# EAGLE design SRV-1_Expansion_Board (EAGLE 6.4)
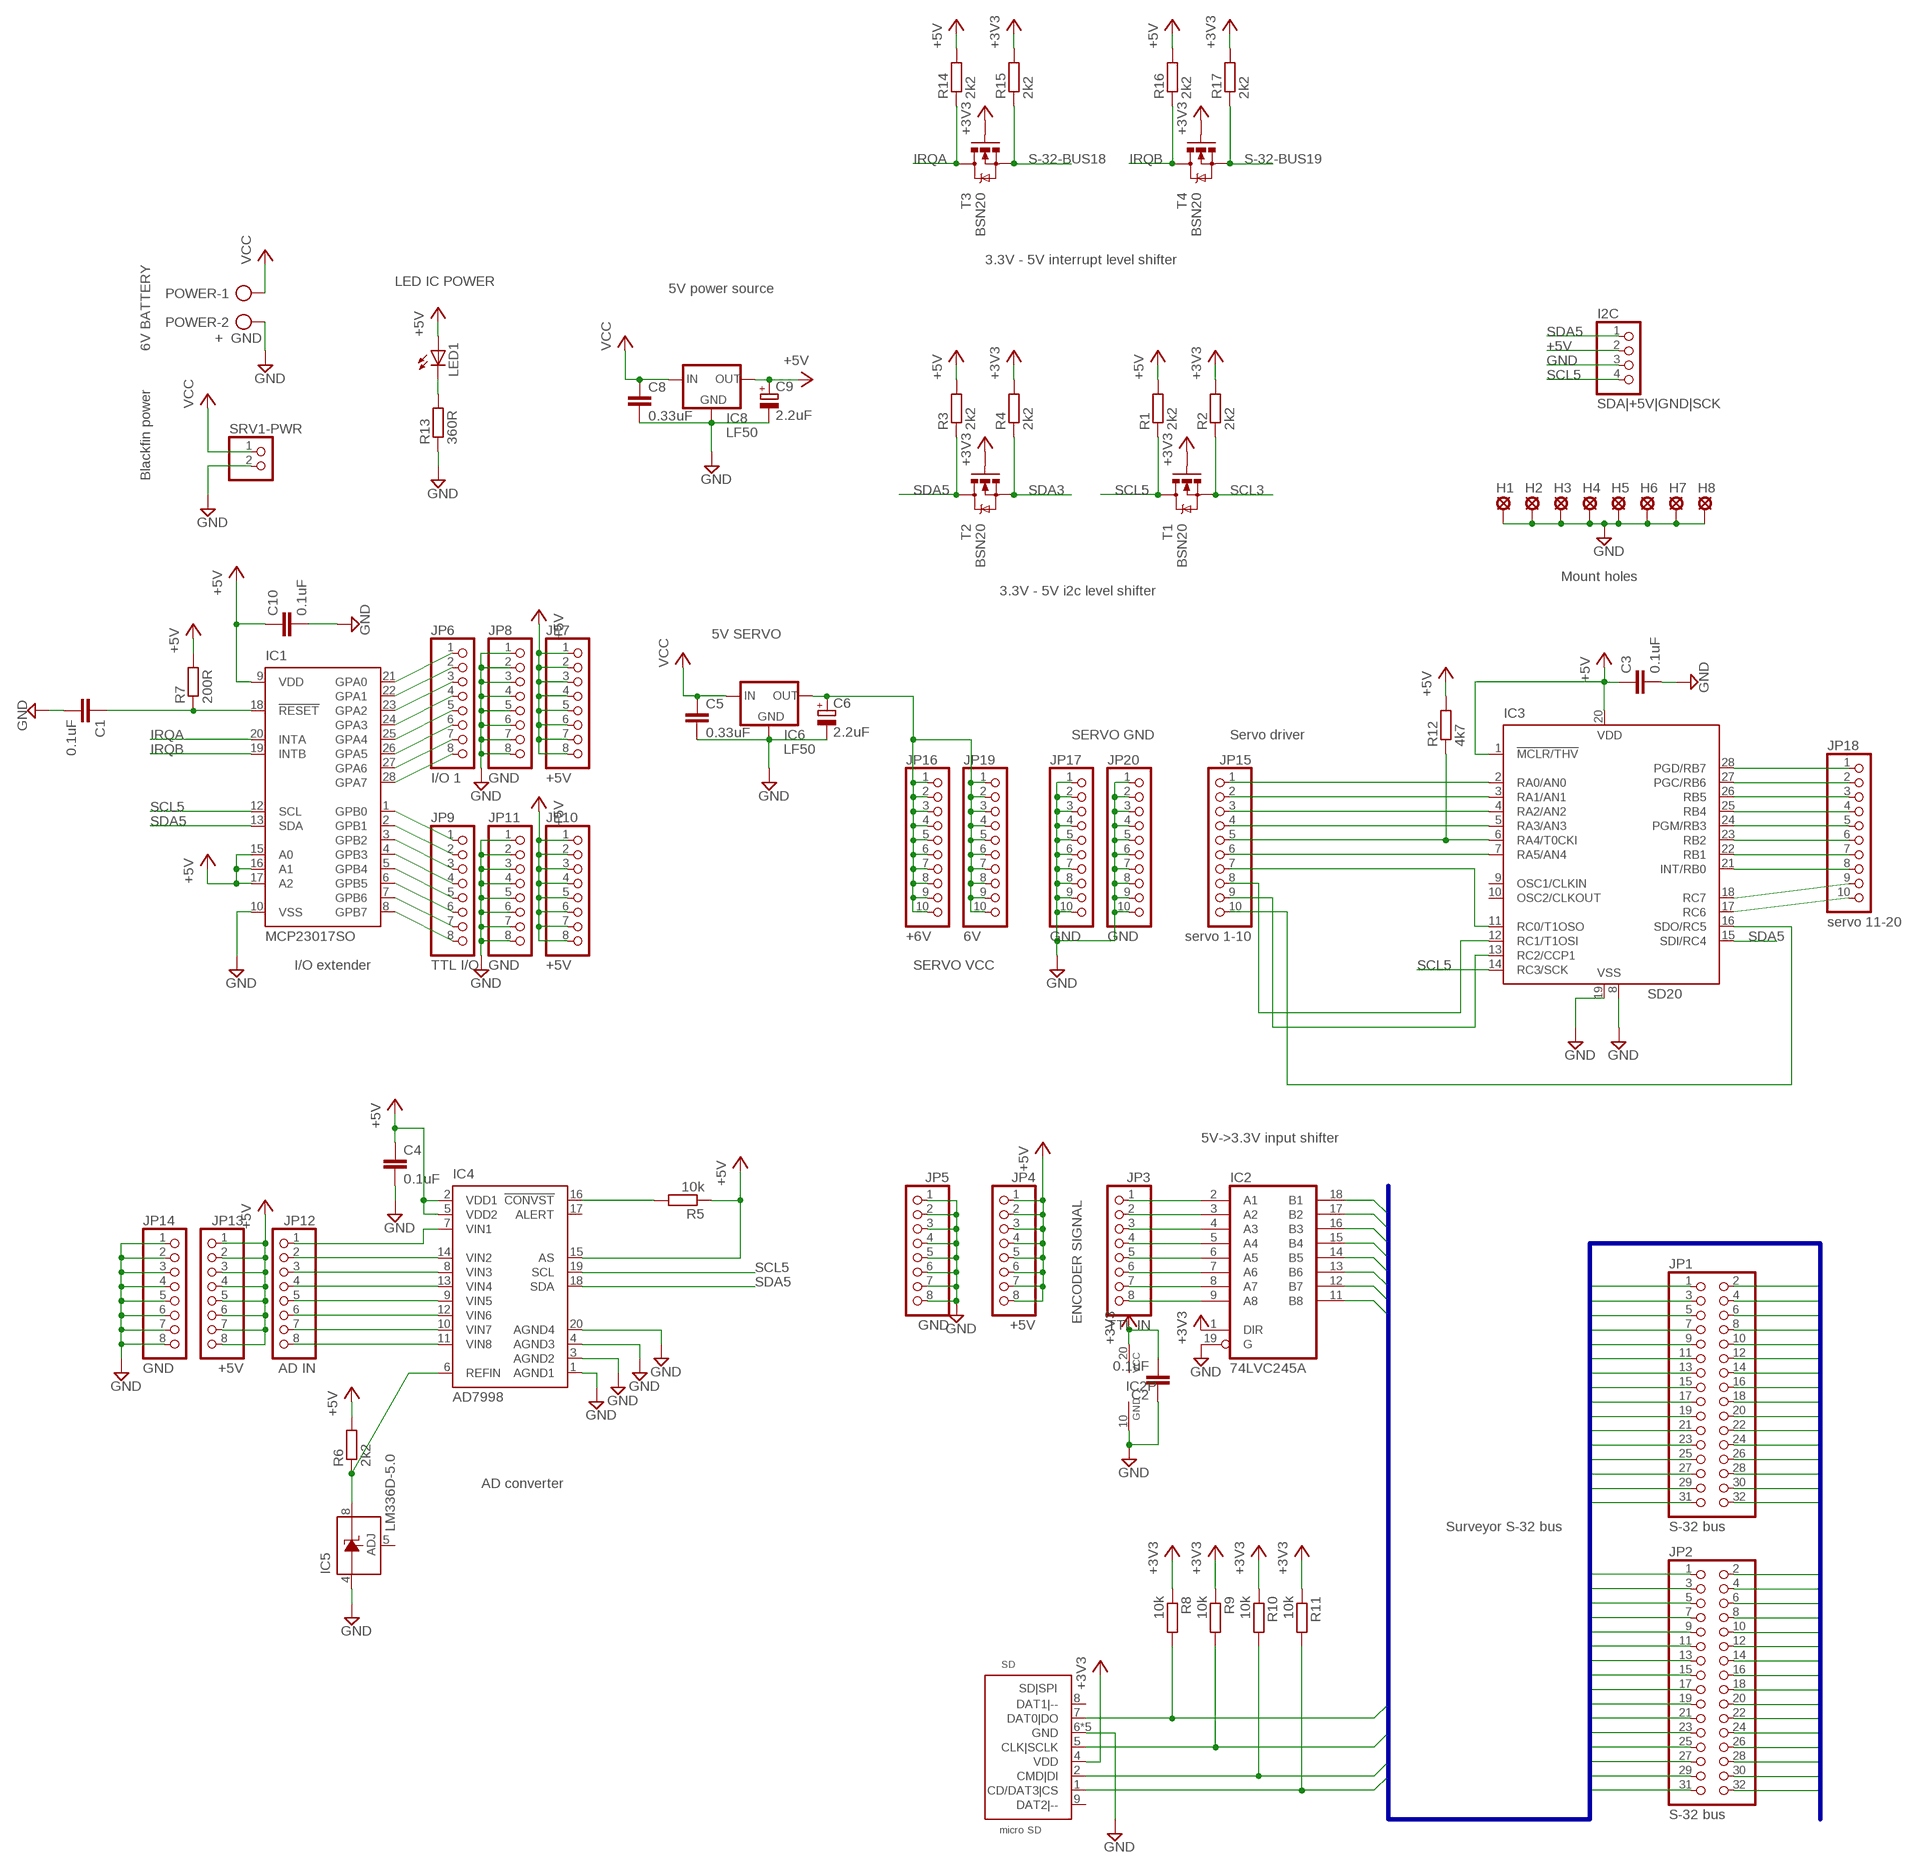
[diagram p0: schematic, sheet 1]

## Parts
C1  0.1uF  CAPACITORC-0805BIG  [0805BIG]
C2  0.1uF  CAPACITORC-0805BIG  [0805BIG]
C3  0.1uF  CAPACITORC-0805BIG  [0805BIG]
C4  0.1uF  CAPACITORC-0805BIG  [0805BIG]
C5  0.33uF  CAPACITORC-0805BIG  [0805BIG]
C6  2.2uF  CPOL-EUE1.8-4  [E1,8-4]
C8  0.33uF  CAPACITORC-0805BIG  [0805BIG]
C9  2.2uF  CPOL-EUE1.8-4  [E1,8-4]
C10  0.1uF  CAPACITORC-0805BIG  [0805BIG]
H1  LSP35  [LSP35]
H2  LSP35  [LSP35]
H3  LSP35  [LSP35]
H4  LSP35  [LSP35]
H5  LSP40  [LSP40]
H6  LSP40  [LSP40]
H7  LSP40  [LSP40]
H8  LSP40  [LSP40]
I2C  SDA|+5V|GND|SCK  PINHD-1X4  [1X04]
IC1  MCP23017SO  [SO28W]
IC2  74LVC245A  74LS245DW  [SO20W]
IC3  SD20  PIC16F872P  [DIL28-3]
IC4  AD7998  [TSSOP20]
IC5  LM336D-5.0  LM336D  [SO08]
IC6  LF50  78XXCDT  [DPAK]
IC8  LF50  78XXCDT  [DPAK]
JP1  S-32 bus  PINHD-2X16  [2X16]
JP2  S-32 bus  PINHD-2X16  [2X16]
JP3  TTL IN  PINHD-1X8  [1X08]
JP4  +5V  PINHD-1X8  [1X08]
JP5  GND  PINHD-1X8  [1X08]
JP6  I/O 1  PINHD-1X8  [1X08]
JP7  +5V  PINHD-1X8  [1X08]
JP8  GND  PINHD-1X8  [1X08]
JP9  TTL I/O  PINHD-1X8  [1X08]
JP10  +5V  PINHD-1X8  [1X08]
JP11  GND  PINHD-1X8  [1X08]
JP12  AD IN  PINHD-1X8  [1X08]
JP13  +5V  PINHD-1X8  [1X08]
JP14  GND  PINHD-1X8  [1X08]
JP15  servo 1-10  PINHD-1X10  [1X10]
JP16  +6V  PINHD-1X10  [1X10]
JP17  GND  PINHD-1X10  [1X10]
JP18  servo 11-20  PINHD-1X10  [1X10]
JP19  6V  PINHD-1X10  [1X10]
JP20  GND  PINHD-1X10  [1X10]
LED1  LEDCHIPLED_1206  [CHIPLED_1206]
POWER  + GND  AK500/2  [AK500/2]
R1  2k2  RESISTORR-0805BIG  [0805BIG]
R2  2k2  RESISTORR-0805BIG  [0805BIG]
R3  2k2  RESISTORR-0805BIG  [0805BIG]
R4  2k2  RESISTORR-0805BIG  [0805BIG]
R5  10k  RESISTORR-0805BIG  [0805BIG]
R6  2k2  RESISTORR-0805BIG  [0805BIG]
R7  200R  RESISTORR-0805BIG  [0805BIG]
R8  10k  RESISTORR-0805BIG  [0805BIG]
R9  10k  RESISTORR-0805BIG  [0805BIG]
R10  10k  RESISTORR-0805BIG  [0805BIG]
R11  10k  RESISTORR-0805BIG  [0805BIG]
R12  4k7  RESISTORR-0805BIG  [0805BIG]
R13  360R  RESISTORR-0805BIG  [0805BIG]
R14  2k2  RESISTORR-0805BIG  [0805BIG]
R15  2k2  RESISTORR-0805BIG  [0805BIG]
R16  2k2  RESISTORR-0805BIG  [0805BIG]
R17  2k2  RESISTORR-0805BIG  [0805BIG]
SD  micro SD  MICRO-SD_CARD_SOCKET  [SD-500901-0801]
SRV1-PWR  PINHD-1X2  [1X02]
T1  BSN20  [SOT23]
T2  BSN20  [SOT23]
T3  BSN20  [SOT23]
T4  BSN20  [SOT23]

## Nets
+3V3: C2.2 IC2.1(DIR) IC2.20(VCC) JP1.1 JP2.1 R2.2 R4.2 R8.1 R9.1 R10.1 R11.1 R15.2 R17.2 SD.4(VDD) T1.1(G) T2.1(G) T3.1(G) T4.1(G)
+5V: C3.1 C4.1 C9.+ C10.1 I2C.2 IC1.9(VDD) IC1.15(A0) IC1.16(A1) IC1.17(A2) IC3.1(!MCLR/THV) IC3.20(VDD) IC4.2(VDD1) IC4.5(VDD2) IC4.15(AS) IC8.3(OUT) JP4.1 JP4.2 JP4.3 JP4.4 JP4.5 JP4.6 JP4.7 JP4.8 JP7.1 JP7.2 JP7.3 JP7.4 JP7.5 JP7.6 JP7.7 JP7.8 JP10.1 JP10.2 JP10.3 JP10.4 JP10.5 JP10.6 JP10.7 JP10.8 JP13.1 JP13.2 JP13.3 JP13.4 JP13.5 JP13.6 JP13.7 JP13.8 LED1.A R1.2 R3.2 R5.1 R6.2 R7.2 R12.2 R14.2 R16.2
GND: C1.2 C2.1 C3.2 C4.2 C5.2 C6.- C8.2 C9.- C10.2 H1.MP H2.MP H3.MP H4.MP H5.MP H6.MP H7.MP H8.MP I2C.3 IC1.10(VSS) IC2.10(GND) IC2.19(G) IC3.8(VSS) IC3.19(VSS) IC4.1(AGND1) IC4.3(AGND2) IC4.4(AGND3) IC4.20(AGND4) IC5.4(A) IC6.2(GND) IC8.2(GND) JP1.2 JP1.16 JP2.2 JP2.16 JP5.1 JP5.2 JP5.3 JP5.4 JP5.5 JP5.6 JP5.7 JP5.8 JP8.1 JP8.2 JP8.3 JP8.4 JP8.5 JP8.6 JP8.7 JP8.8 JP11.1 JP11.2 JP11.3 JP11.4 JP11.5 JP11.6 JP11.7 JP11.8 JP14.1 JP14.2 JP14.3 JP14.4 JP14.5 JP14.6 JP14.7 JP14.8 JP17.1 JP17.2 JP17.3 JP17.4 JP17.5 JP17.6 JP17.7 JP17.8 JP17.9 JP17.10 JP20.1 JP20.2 JP20.3 JP20.4 JP20.5 JP20.6 JP20.7 JP20.8 JP20.9 JP20.10 POWER.2 R13.1 SD.6(GND) SD.GND1(GND) SD.GND2(GND) SD.GND3(GND) SD.GND4(GND) SRV1-PWR.2
IRQA: IC1.20(INTA) R14.1 T3.3(D)
IRQB: IC1.19(INTB) R16.1 T4.3(D)
N$1: IC4.16(!CONVST) R5.2
N$2: IC2.9(A8) JP3.8
N$3: IC1.21(GPA0) JP6.1
N$7: IC1.22(GPA1) JP6.2
N$8: IC4.6(REFIN) IC5.8(C) R6.1
N$9: IC3.2(RA0/AN0) JP15.1
N$10: IC1.23(GPA2) JP6.3
N$11: IC1.24(GPA3) JP6.4
N$12: IC1.25(GPA4) JP6.5
N$13: C1.1 IC1.18(!RESET) R7.1
N$14: IC1.26(GPA5) JP6.6
N$15: IC1.27(GPA6) JP6.7
N$16: IC1.28(GPA7) JP6.8
N$17: IC1.1(GPB0) JP9.1
N$18: IC1.2(GPB1) JP9.2
N$19: IC1.3(GPB2) JP9.3
N$20: IC1.4(GPB3) JP9.4
N$21: IC1.5(GPB4) JP9.5
N$22: IC1.6(GPB5) JP9.6
N$23: IC1.7(GPB6) JP9.7
N$24: IC1.8(GPB7) JP9.8
N$25: IC3.16(SDO/RC5) JP15.10
N$26: IC2.2(A1) JP3.1
N$27: IC2.3(A2) JP3.2
N$28: IC2.4(A3) JP3.3
N$29: IC2.5(A4) JP3.4
N$30: IC2.6(A5) JP3.5
N$31: IC2.7(A6) JP3.6
N$32: IC2.8(A7) JP3.7
N$33: IC4.11(VIN8) JP12.8
N$42: IC3.3(RA1/AN1) JP15.2
N$43: IC3.4(RA2/AN2) JP15.3
N$44: IC3.5(RA3/AN3) JP15.4
N$45: IC3.6(RA4/T0CKI) JP15.5 R12.1
N$46: IC3.7(RA5/AN4) JP15.6
N$47: IC3.11(RC0/T1OSO) JP15.7
N$48: IC3.12(RC1/T1OSI) JP15.8
N$49: IC3.13(RC2/CCP1) JP15.9
N$50: IC3.28(PGD/RB7) JP18.1
N$51: IC3.27(PGC/RB6) JP18.2
N$52: IC3.26(RB5) JP18.3
N$53: IC3.25(RB4) JP18.4
N$54: IC3.24(PGM/RB3) JP18.5
N$55: IC3.23(RB2) JP18.6
N$56: IC3.22(RB1) JP18.7
N$57: IC3.21(INT/RB0) JP18.8
N$58: IC3.18(RC7) JP18.9
N$59: IC3.17(RC6) JP18.10
N$61: IC4.7(VIN1) JP12.1
N$62: IC4.14(VIN2) JP12.2
N$63: IC4.8(VIN3) JP12.3
N$64: IC4.13(VIN4) JP12.4
N$65: IC4.9(VIN5) JP12.5
N$66: IC4.12(VIN6) JP12.6
N$67: IC4.10(VIN7) JP12.7
N$71: LED1.C R13.2
S-32-BUS3: JP1.3 JP2.3
S-32-BUS4: JP1.4 JP2.4
S-32-BUS5: JP1.5 JP2.5
S-32-BUS6: JP1.6 JP2.6
S-32-BUS7: JP1.7 JP2.7
S-32-BUS8: JP1.8 JP2.8
S-32-BUS9: JP1.9 JP2.9 R10.2 SD.2(CMD|DI)
S-32-BUS10: JP1.10 JP2.10 R8.2 SD.7(DAT0|DO)
S-32-BUS11: JP1.11 JP2.11 R9.2 SD.5(CLK|SCLK)
S-32-BUS12: JP1.12 JP2.12 R11.2 SD.1(CD/DAT3|CS)
S-32-BUS13: JP1.13 JP2.13
S-32-BUS17: JP1.17 JP2.17
S-32-BUS18: JP1.18 JP2.18 R15.1 T3.2(S)
S-32-BUS19: JP1.19 JP2.19 R17.1 T4.2(S)
S-32-BUS20: JP1.20 JP2.20
S-32-BUS21: JP1.21 JP2.21
S-32-BUS22: JP1.22 JP2.22
S-32-BUS23: JP1.23 JP2.23
S-32-BUS24: JP1.24 JP2.24
S-32-BUS25: IC2.18(B1) JP1.25 JP2.25
S-32-BUS26: IC2.17(B2) JP1.26 JP2.26
S-32-BUS27: IC2.16(B3) JP1.27 JP2.27
S-32-BUS28: IC2.15(B4) JP1.28 JP2.28
S-32-BUS29: IC2.14(B5) JP1.29 JP2.29
S-32-BUS30: IC2.13(B6) JP1.30 JP2.30
S-32-BUS31: IC2.12(B7) JP1.31 JP2.31
S-32-BUS32: IC2.11(B8) JP1.32 JP2.32
SCL3: JP1.14 JP2.14 R2.1 T1.2(S)
SCL5: I2C.4 IC1.12(SCL) IC3.14(RC3/SCK) IC4.19(SCL) R1.1 T1.3(D)
SDA3: JP1.15 JP2.15 R4.1 T2.2(S)
SDA5: I2C.1 IC1.13(SDA) IC3.15(SDI/RC4) IC4.18(SDA) R3.1 T2.3(D)
SERVO+5V: C6.+ IC6.3(OUT) JP16.1 JP16.2 JP16.3 JP16.4 JP16.5 JP16.6 JP16.7 JP16.8 JP16.9 JP16.10 JP19.1 JP19.2 JP19.3 JP19.4 JP19.5 JP19.6 JP19.7 JP19.8 JP19.9 JP19.10
VCC: C5.1 C8.1 IC6.1(IN) IC8.1(IN) POWER.1 SRV1-PWR.1
Unconnected: IC3.9(OSC1/CLKIN) IC3.10(OSC2/CLKOUT) IC4.17(ALERT) IC5.5(ADJ) SD.8(DAT1|--) SD.9(DAT2|--)

## Buses
+3V3,GND,S-32-BUS[3..13],SCL3,SDA3,S-32-BUS[17..32]

## Notes on the sheet
- 3.3V - 5V interrupt level shifter
- LED IC POWER
- 5V power source
- 6V BATTERY
- Blackfin power
- Mount holes
- 3.3V - 5V i2c level shifter
- 5V SERVO
- SERVO GND | Servo driver
- I/O extender | SERVO VCC
- 5V->3.3V input shifter
- ENCODER SIGNAL
- AD converter
- Surveyor S-32 bus

## Library data of the parts
C1-C5 C8 C10 = MART2013:CAPACITOR
C6 C9 = resistor:CPOL-EU: POLARIZED CAPACITOR, European symbol
H1-H4 = solpad:LSP35: SOLDER PAD drill 3.5 mm
H5-H8 = solpad:LSP40: SOLDER PAD drill 4.0 mm
I2C = pinhead:PINHD-1X4: PIN HEADER
IC1 = edited:MCP23017: http://ww1.microchip.com/downloads/en/DeviceDoc/21952a.pdf Source: http://ww1.microchip.com/downloads/en/DeviceDoc/21952a.pdf; MF: MICROCHIP; MPN: MCP23017-E/SO; OC_FARNELL: 1332087; OC_NEWARK: 31K2958
IC2 = 74xx-eu:74*245: Octal BUS TRANSCEIVER, 3-state
IC3 = microchip:PIC16*872: MICROCONTROLLER flash type; MF: MICROCHIP; MPN: PIC16F872-I/SP; OC_FARNELL: 9761012; OC_NEWARK: 12C1945
IC4 = edited:AD7998: 2-Channel, 12-Bit ADC with I2C-Compatible Interface 10-Lead MSOP Source: http://www.analog.com/UploadedFiles/Data_Sheets/224965274AD7992_0.pdf
IC5 = linear:LM336: 2.5-V INTEGRATED REFERENCE CIRCUITS LM236 Source: http://focus.ti.com/lit/ds/symlink/lm336-2.5.pdf
IC6 IC8 = Davidova:78XX: VOLTAGE REGULATOR
JP1 JP2 = pinhead:PINHD-2X16: PIN HEADER
JP3-JP14 = pinhead:PINHD-1X8: PIN HEADER
JP15-JP20 = pinhead:PINHD-1X10: PIN HEADER
LED1 = led:LED: LED OSRAM: - CHIPLED LG R971, LG N971, LY N971, LG Q971, LY Q971, LO R971, LY R971 LH N974, LH R974 LS Q976, LO Q976, LY Q976 LO Q996 - Hyper CHIPLED LW Q18S LB Q993, LB Q99A, LB R99A - SideLED LS A670, LO A670, LY A670, LG A670, LP A670 LB A673, LV A673, LT A673, LW A673 LH A674 LY A675 LS A676, LA A676, LO A676, LY A676, LW A676 LS A679, LY A679, LG A679 - Hyper Micro SIDELED® LS Y876, LA Y876, LO Y876, LY Y876 LT Y87S - SmartLED LW L88C, LW L88S LB L89C, LB L89S, LG L890 LS L89K, LO L89K, LY L89K LS L896, LA L896, LO L896, LY L896 - TOPLED LS T670, LO T670, LY T670, LG T670, LP T670 LSG T670, LSP T670, LSY T670, LOP T670, LYG T670 LG T671, LOG T671, LSG T671 LB T673, LV T673, LT T673, LW T673 LH T674 LS T676, LA T676, LO T676, LY T676, LB T676, LH T676, LSB T676, LW T676 LB T67C, LV T67C, LT T67C, LS T67K, LO T67K, LY T67K, LW E67C LS E67B, LA E67B, LO E67B, LY E67B, LB E67C, LV E67C, LT E67C LW T67C LS T679, LY T679, LG T679 LS T770, LO T770, LY T770, LG T770, LP T770 LB T773, LV T773, LT T773, LW T773 LH T774 LS E675, LA E675, LY E675, LS T675 LS T776, LA T776, LO T776, LY T776, LB T776 LHGB T686 LT T68C, LB T68C - Hyper Mini TOPLED® LB M676 - Mini TOPLED Santana® LG M470 LS M47K, LO M47K, LY M47K Source: http://www.osram.convergy.de LUXEON: - LUMILED® LXK2-PW12-R00, LXK2-PW12-S00, LXK2-PW14-U00, LXK2-PW14-V00 LXK2-PM12-R00, LXK2-PM12-S00, LXK2-PM14-U00 LXK2-PE12-Q00, LXK2-PE12-R00, LXK2-PE12-S00, LXK2-PE14-T00, LXK2-PE14-U00 LXK2-PB12-K00, LXK2-PB12-L00, LXK2-PB12-M00, LXK2-PB14-N00, LXK2-PB14-P00, LXK2-PB14-Q00 LXK2-PR12-L00, LXK2-PR12-M00, LXK2-PR14-Q00, LXK2-PR14-R00 LXK2-PD12-Q00, LXK2-PD12-R00, LXK2-PD12-S00 LXK2-PH12-R00, LXK2-PH12-S00 LXK2-PL12-P00, LXK2-PL12-Q00, LXK2-PL12-R00 Source: www.luxeon.com KINGBRIGHT: KA-3528ASYC Source: www.kingbright.com
POWER = con-ptr500:AK500/2: CONNECTOR; OC_FARNELL: unknown; OC_NEWARK: unknown
R1-R17 = MART2013:RESISTOR: RESISTOR, European symbol
SD = Davidova:MICRO-SD_CARD_SOCKET
SRV1-PWR = pinhead:PINHD-1X2: PIN HEADER
T1-T4 = edited:BSN20

## Net classes
0 default: clearance 0.355 mm

## Board
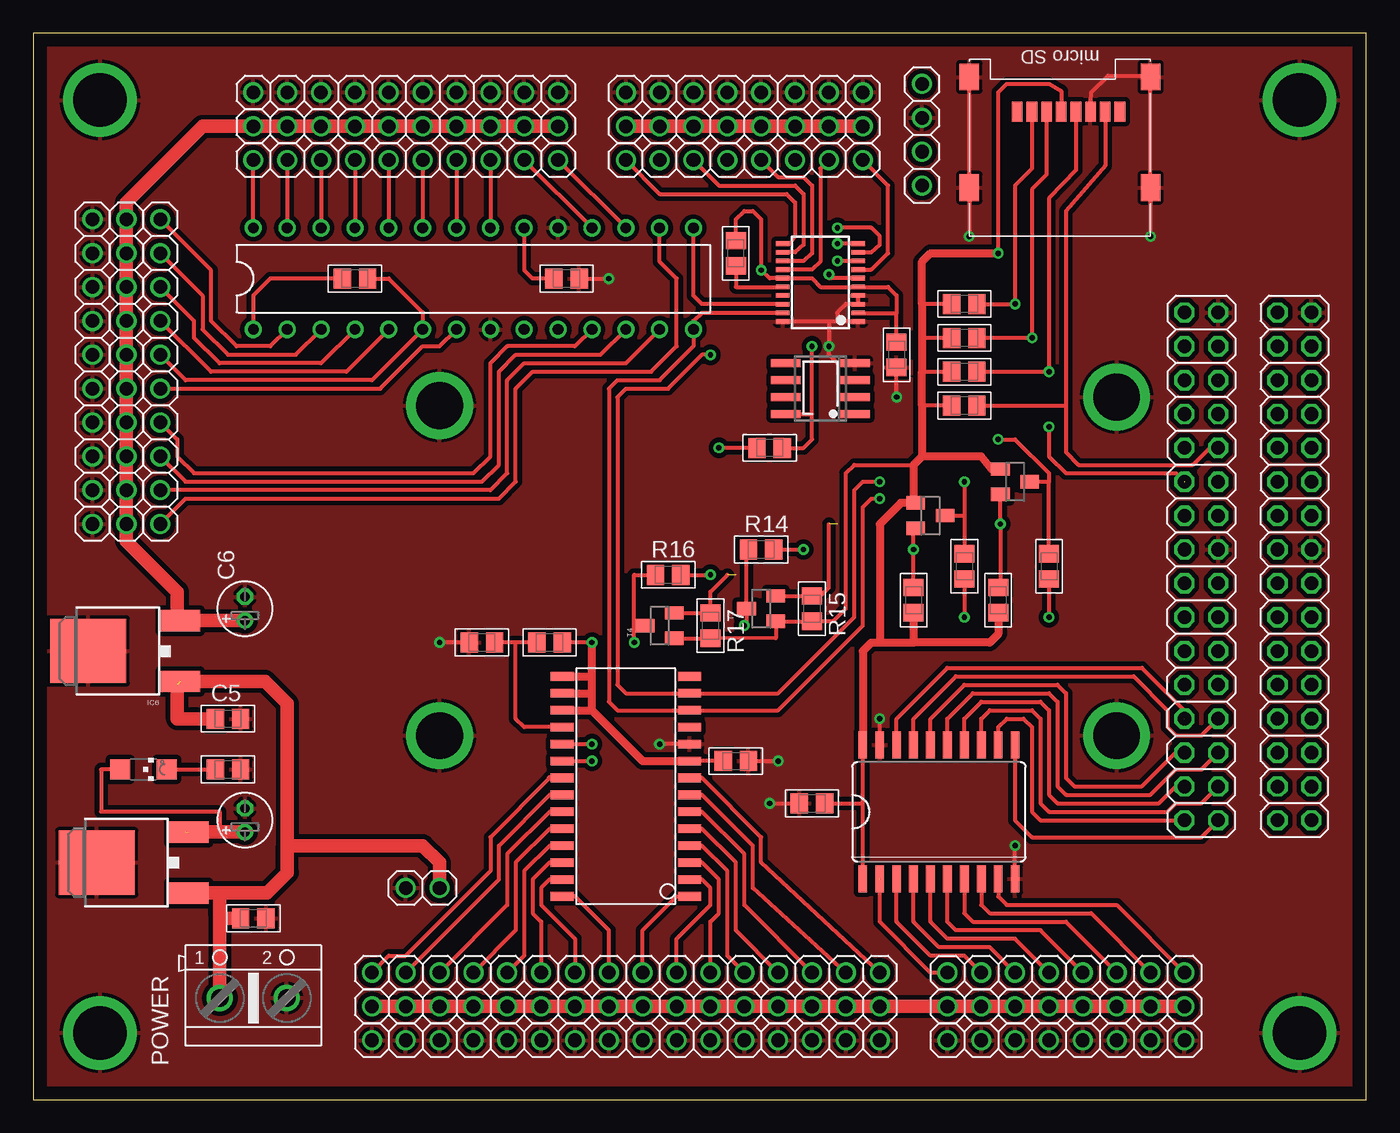
[diagram p1: board, top side]
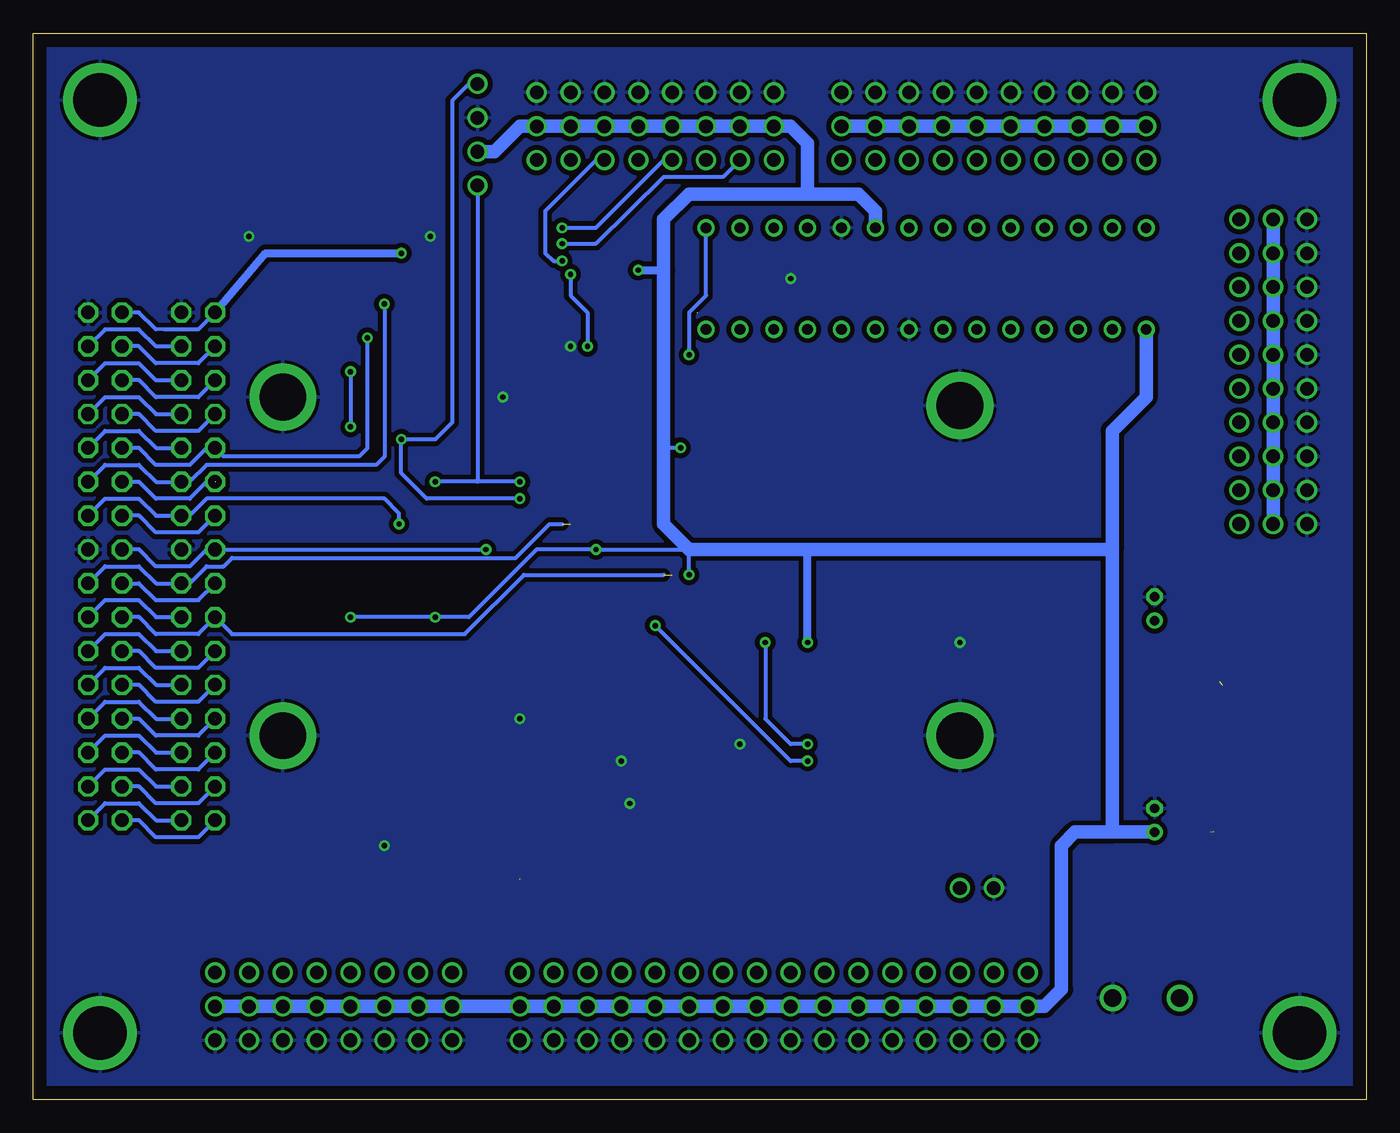
[diagram p2: board, bottom side, seen from below]

Size 100 x 80 mm. Coordinates in mm from the lower left corner, seen from the top.
Outline: 0,0 100,0 100,80 0,80 0,0
Copper layers (1*16): Top 0.035mm / dielectric 1.5mm / Bottom 0.035mm
Design rules "default": minimum track width 0.15mm, minimum drill 0.3mm, track to track 8mil, track to pad 8mil, pad to pad 8mil, via to via 8mil, smd to smd 8mil, copper to edge 40mil, drill to drill 8mil, minimum pad ring 10mil, minimum via ring 8mil, stop-mask expansion 4mil, vias tented up to drill 0mil, thermal gap 10mil

### Footprints (pad centres in the part's own frame; a part is rotated, then mirrored left to right if it is on the bottom)
0805BIG = smd 1.3 x 1.5: 1 -0.95,0; 2 0.95,0
E1,8-4 = drill 0.711 pad 1.168: + -0.889,0 | drill 0.711 pad 1.168 octagon: - 0.889,0
LSP35 = drill 3.5 pad 5: MP 0,0
LSP40 = drill 4 pad 5.5: MP 0,0
1X04 = drill 1.016 long: 1 -3.81,0; 2 -1.27,0; 3 1.27,0; 4 3.81,0
SO28W = smd 0.65 x 1.7: 1 -7.62,-4.78; 2 -6.35,-4.78; 3 -5.08,-4.78; 4 -3.81,-4.78; 5 -2.54,-4.78; 6 -1.27,-4.78; 7 0,-4.78; 8 1.27,-4.78; 9 2.54,-4.78; 10 3.81,-4.78; 11 5.08,-4.78; 12 6.35,-4.78; 13 7.62,-4.78; 14 8.89,-4.78; 15 8.89,4.78; 16 7.62,4.78; 17 6.35,4.78; 18 5.08,4.78; 19 3.81,4.78; 20 2.54,4.78; 21 1.27,4.78; 22 0,4.78; 23 -1.27,4.78; 24 -2.54,4.78; 25 -3.81,4.78; 26 -5.08,4.78; 27 -6.35,4.78; 28 -7.62,4.78
SO20W = smd 0.66 x 2.032: 1 -5.715,-5.029; 2 -4.445,-5.029; 3 -3.175,-5.029; 4 -1.905,-5.029; 5 -0.635,-5.029; 6 0.635,-5.029; 7 1.905,-5.029; 8 3.175,-5.029; 9 4.445,-5.029; 10 5.715,-5.029; 11 5.715,5.029; 12 4.445,5.029; 13 3.175,5.029; 14 1.905,5.029; 15 0.635,5.029; 16 -0.635,5.029; 17 -1.905,5.029; 18 -3.175,5.029; 19 -4.445,5.029; 20 -5.715,5.029
DIL28-3 = drill 0.813 long: 1 -16.51,-3.81; 2 -13.97,-3.81; 3 -11.43,-3.81; 4 -8.89,-3.81; 5 -6.35,-3.81; 6 -3.81,-3.81; 7 -1.27,-3.81; 8 1.27,-3.81; 9 3.81,-3.81; 10 6.35,-3.81; 11 8.89,-3.81; 12 11.43,-3.81; 13 13.97,-3.81; 14 16.51,-3.81; 15 16.51,3.81; 16 13.97,3.81; 17 11.43,3.81; 18 8.89,3.81; 19 6.35,3.81; 20 3.81,3.81; 21 1.27,3.81; 22 -1.27,3.81; 23 -3.81,3.81; 24 -6.35,3.81; 25 -8.89,3.81; 26 -11.43,3.81; 27 -13.97,3.81; 28 -16.51,3.81
TSSOP20 = smd 0.35 x 1: 1 -1.95,-2.825; 2 -1.3,-2.825; 3 -0.65,-2.825; 4 0,-2.825; 5 0.65,-2.825; 6 1.3,-2.825; 7 1.95,-2.825; 8 2.6,-2.825; 9 3.25,-2.825; 10 3.9,-2.825; 11 3.9,2.825; 12 3.25,2.825; 13 2.6,2.825; 14 1.95,2.825; 15 1.3,2.825; 16 0.65,2.825; 17 0,2.825; 18 -0.65,2.825; 19 -1.3,2.825; 20 -1.95,2.825
SO08 = smd 0.6 x 2.2: 1 -1.905,-2.6; 2 -0.635,-2.6; 3 0.635,-2.6; 4 1.905,-2.6; 5 1.905,2.6; 6 0.635,2.6; 7 -0.635,2.6; 8 -1.905,2.6
DPAK = smd 1.6 x 3: 1 -2.28,-5.31; 3 2.28,-5.31 | smd 4.826 x 5.715: 2 0,1.588
2X16 = drill 1.016 octagon: 1 -19.05,-1.27; 2 -19.05,1.27; 3 -16.51,-1.27; 4 -16.51,1.27; 5 -13.97,-1.27; 6 -13.97,1.27; 7 -11.43,-1.27; 8 -11.43,1.27; 9 -8.89,-1.27; 10 -8.89,1.27; 11 -6.35,-1.27; 12 -6.35,1.27; 13 -3.81,-1.27; 14 -3.81,1.27; 15 -1.27,-1.27; 16 -1.27,1.27; 17 1.27,-1.27; 18 1.27,1.27; 19 3.81,-1.27; 20 3.81,1.27; 21 6.35,-1.27; 22 6.35,1.27; 23 8.89,-1.27; 24 8.89,1.27; 25 11.43,-1.27; 26 11.43,1.27; 27 13.97,-1.27; 28 13.97,1.27; 29 16.51,-1.27; 30 16.51,1.27; 31 19.05,-1.27; 32 19.05,1.27
1X08 = drill 1.016 long: 1 -8.89,0; 2 -6.35,0; 3 -3.81,0; 4 -1.27,0; 5 1.27,0; 6 3.81,0; 7 6.35,0; 8 8.89,0
1X10 = drill 1.016 long: 1 -11.43,0; 2 -8.89,0; 3 -6.35,0; 4 -3.81,0; 5 -1.27,0; 6 1.27,0; 7 3.81,0; 8 6.35,0; 9 8.89,0; 10 11.43,0
CHIPLED_1206 = smd 1.5 x 1.5: A 0,-1.75; C 0,1.75
AK500/2 = drill 1.321 long: 1 -2.515,0; 2 2.515,0
SD-500901-0801 = smd 0.8 x 1.5: 1 -8.9,9.35; 2 -7.8,9.35; 4 -6.7,9.35; 5 -5.6,9.35; 6 -4.5,9.35; 7 -3.4,9.35; 8 -2.3,9.35; 9 -10,9.35 | smd 1.45 x 2: GND1 -13.6,11.95; GND2 0,11.95; GND3 -13.6,3.65; GND4 0,3.65
1X02 = drill 1.016 long: 1 -1.27,0; 2 1.27,0
SOT23 = smd 1 x 1.4: 1 -0.95,-1.1; 2 0.95,-1.1; 3 0,1.1

### Placement (x,y rotation side)
C1  33.66,34.29 180 top
C2  58.42,22.23 0 top
C3  40.01,61.59 0 top
C4  64.77,55.88 270 top
C5  14.61,28.57 0 top
C6  15.88,36.83 90 top
C8  16.51,13.6 0 top
C9  15.88,20.95 90 top
C10  52.7,25.4 0 top
H1  30.48,27.3 0 top
H2  30.48,52.07 0 top
H3  81.28,27.3 0 top
H4  81.28,52.7 0 top
H5  5,5 0 top
H6  5,75 0 top
H7  95,75 0 top
H8  95,5 0 top
I2C  66.67,72.39 90 top
IC1  44.45,22.86 90 top
IC2  67.94,21.59 0 top
IC3  33.02,61.59 0 top
IC4  59.05,60.33 90 top
IC5  59.05,53.34 90 top
IC6  5.71,33.66 90 top
IC8  6.35,17.78 90 top
JP1  94.61,40 270 top
JP2  87.63,40 270 top
JP3  77.47,9.53 0 top
JP4  77.47,6.99 0 top
JP5  77.47,4.45 0 top
JP6  34.29,9.53 0 top
JP7  34.29,6.99 0 top
JP8  34.29,4.45 0 top
JP9  54.61,9.53 0 top
JP10  54.61,6.99 0 top
JP11  54.61,4.45 0 top
JP12  53.34,70.48 180 top
JP13  53.34,73.03 180 top
JP14  53.34,75.56 180 top
JP15  9.53,54.61 270 top
JP16  6.99,54.61 270 top
JP17  4.45,54.61 270 top
JP18  27.94,70.48 0 top
JP19  27.94,73.03 0 top
JP20  27.94,75.56 0 top
LED1  8.26,24.77 270 top
POWER  16.51,7.62 0 top
R1  76.2,40.01 270 top
R2  72.39,37.47 270 top
R3  69.85,40.01 270 top
R4  66.04,37.47 270 top
R5  52.7,63.5 270 top
R6  55.24,48.9 180 top
R7  38.73,34.29 0 top
R8  69.85,52.07 0 top
R9  69.85,54.61 0 top
R10  69.85,57.15 0 top
R11  69.85,59.69 0 top
R12  24.13,61.59 180 top
R13  14.61,24.77 180 top
R14  54.61,41.27 0 top
R15  58.42,36.83 270 top
R16  47.62,39.37 0 top
R17  50.8,35.56 270 top
SD  83.82,64.77 0 top
SRV1-PWR  29.21,15.88 180 top
T1  73.66,46.35 270 top
T2  67.31,43.81 270 top
T3  54.61,36.83 90 top
T4  46.99,35.56 90 top

### Tracks (layer width: path | path; a pad name or v marks a point on that pad's centre or on a via)
+3V3  (via drill 0.4)
  Top 0.305: IC2.1 62.23,22.23 | 62.23,22.23 IC2.20 | R8.1 66.67,52.07 | 66.67,54.61 R9.1 | R10.1 66.67,57.15 | R11.1 66.67,59.69 | v72.39,63.5 72.39,75.56 73.03,76.2 76.2,76.2 77.12,75.67 SD.4 | T1.1 71.88,47.3 | 66.04,44.94 T2.1 | C2.2 62.23,22.23 | T4.1 R17.2 | 66.04,47.62 61.59,47.62 60.96,46.99 60.96,36.83 60.01,35.88 R15.2 | R15.2 T3.1 55.71,34.61 R17.2 | 58.95,35.88 R15.2 | 51.22,34.29 R17.2
  Top 0.61: v72.39,63.5 67.31,63.5 66.67,62.87 66.67,59.69 66.67,57.15 66.67,54.61 66.67,52.07 66.67,48.26 | 71.88,47.3 71.12,48.26 66.67,48.26 | 66.67,48.26 66.04,47.62 66.04,44.94 | R4.2 66.04,34.29 | R2.2 72.39,34.92 71.75,34.29 66.04,34.29 | T2.1 65.08,44.77 63.5,43.18 63.5,34.29 | 63.5,34.29 66.04,34.29 | IC2.20 62.23,33.66 62.87,34.29 63.5,34.29
  Bottom 0.305: JP2.1 87.63,57.78 90.17,57.78 90.81,57.79 92.08,59.05 JP1.1
  Bottom 0.61: JP2.1 82.56,63.49 v72.39,63.5
+5V  (via drill 0.4)  (1 unrouted)
  Top 0.305: IC3.20 36.83,62.23 37.47,61.59 C3.1 | 56.2,61.59 IC4.15 | IC4.2 64.77,59.02 | IC4.15 58.42,61.62 59.05,60.96 61.87,60.96 | 61.87,60.96 IC4.5 | R12.2 17.78,61.59 16.51,60.33 IC3.1 | R6.2 v51.44,48.9 | R1.2 v76.2,36.2 | 61.87,60.96 64.14,60.96 64.77,60.33 64.77,59.02 | C4.1 64.77,59.02 | R5.1 52.7,66.04 53.34,66.67 53.98,66.67 54.61,66.04 v54.61,62.23 55.24,61.62 IC4.15 | R3.2 v69.85,36.2 | 13.97,20.07 13.97,21.59 5.08,21.59 5.08,24.77 LED1.A | v41.91,34.29 R7.2 | C10.1 IC1.9 | R14.2 v57.78,41.27 | R16.2 v50.8,39.37
  Top 0.61: IC1.9 45.72,25.4 41.91,29.21 | 41.91,29.21 41.91,30.48 | 41.91,30.48 41.91,31.75 | 41.91,31.75 v41.91,34.29 | IC1.17 41.91,29.21 | IC1.16 41.91,30.48 | IC1.15 41.91,31.75
  Top 1.016: JP7.1 JP4.8 | JP13.8 JP13.1 | C9.+ 13.97,20.07 11.43,20.07
  Bottom 0.305: v76.2,36.2 v69.85,36.2 67.31,36.2 62.23,41.27 v57.78,41.27 50.8,41.27 v50.8,39.37 | v51.44,48.9 52.7,48.9
  Bottom 0.61: v41.91,34.29 41.91,41.27 | v54.61,62.23 52.7,62.23
  Bottom 1.016: 19.05,20.07 19.05,41.27 | 19.05,41.27 41.91,41.27 50.8,41.27 52.7,43.18 52.7,48.9 52.7,62.23 52.7,66.04 50.8,67.94 41.91,67.94 | 41.91,67.94 41.91,71.75 43.18,73.03 JP13.8 JP13.7 JP13.6 JP13.5 JP13.4 JP13.3 JP13.2 JP13.1 63.5,73.03 65.41,71.12 I2C.2 | 19.05,41.27 19.05,50.16 16.51,52.7 IC3.1 | 41.91,67.94 38.1,67.94 36.83,66.67 IC3.20 | JP4.8 JP4.7 JP4.6 JP4.5 JP4.4 JP4.3 JP4.2 JP4.1 JP10.8 JP10.7 JP10.6 JP10.5 JP10.4 JP10.3 JP10.2 JP10.1 JP7.8 JP7.7 JP7.6 JP7.5 JP7.4 JP7.3 JP7.2 JP7.1 24.13,6.99 22.86,8.26 22.86,19.05 21.84,20.07 19.05,20.07 | C9.+ 19.05,20.07
GND  (via drill 0.4)
  Top 0.305: C3.2 v43.18,61.59 | v64.77,52.7 C4.2 | IC4.1 60.37,58.38 | 59.69,58.38 IC4.20 | 60.33,58.38 60.33,59.04 60.34,59.07 60.96,59.69 IC4.3 IC4.4 | 60.33,58.38 59.69,58.38 | v55.24,22.23 C2.1 | IC5.4 60.33,55.24 59.69,55.88 v59.69,56.52 59.69,58.38 | IC1.10 v46.99,26.67 | IC2.19 v63.5,28.57 | IC2.10 v73.66,19.05 | SD.6 79.38,75.56 80.64,76.83 83.82,76.83 SD.GND4 v83.82,64.77 | 70.22,76.83 SD.GND3 v70.22,64.77 | 61.88,58.37 60.33,58.38 | C1.2 v30.48,34.29 | C10.2 v55.88,25.4
  pour Bottom: 0,80 100,80 100,0 0,0
  pour Top: 0,80 100,80 100,0 0,0
IRQA  (via drill 0.4)
  Top 0.305: R14.1 53.51,41.02 T3.3 53.51,35.73 v53.34,35.56 | IC1.20 v41.91,25.4
  Bottom 0.305: v41.91,25.4 43.18,25.4 v53.34,35.56
IRQB  (via drill 0.4, 0.4 pad 0.3)
  Top 0.305: IC1.19 v41.91,26.67 | v45.09,34.29 45.09,35.56 | 45.09,35.56 45.09,39.37 R16.1 | T4.3 45.09,35.56
  Bottom 0.305: v45.09,34.29 45.09,28.57 43.18,26.67 v41.91,26.67
N$1
  Top 0.305: R5.2 52.7,60.98 IC4.16
N$2
  Top 0.305: IC2.9 72.39,15.24 73.03,14.61 81.28,14.61 JP3.8
N$3
  Top 0.305: 38.73,24.13 34.29,19.68 34.29,17.14 27.94,10.79 26.67,10.79 JP6.1
  Top 0.406: IC1.21 38.73,24.13
N$7
  Top 0.305: IC1.22 38.73,22.86 34.92,19.05 34.92,16.51 JP6.2
N$8  (via drill 0.4)
  Top 0.305: IC4.6 59.72,61.62 v59.69,61.91 | R6.1 57.78,48.9 58.42,49.53 58.42,51.44 | IC5.8 58.42,51.44 | 58.42,51.44 v58.42,56.52
  Bottom 0.305: v59.69,61.91 59.69,60.33 58.42,59.05 v58.42,56.52
N$9
  Top 0.305: IC3.2 17.78,56.52 15.24,56.52 13.34,58.42 13.34,62.23 JP15.1
N$10
  Top 0.305: IC1.23 38.73,21.59 35.56,18.41 35.56,14.61 JP6.3
N$11
  Top 0.305: IC1.24 38.73,20.32 36.2,17.78 36.2,12.7 JP6.4
N$12
  Top 0.305: IC1.25 38.73,19.05 36.83,17.14 36.83,10.79 JP6.5
N$13
  Top 0.305: R7.1 36.2,34.29 | 36.2,34.29 C1.1 | IC1.18 36.83,27.94 36.2,28.57 36.2,34.29
N$14
  Top 0.305: IC1.26 38.73,17.78 37.47,16.51 37.47,13.97 38.1,13.34 JP6.6
N$15
  Top 0.305: IC1.27 38.73,16.51 38.1,15.88 38.1,14.61 40.64,12.06 JP6.7
N$16
  Top 0.305: JP6.8 43.18,12.7 40.64,15.24 IC1.28
N$17
  Top 0.305: JP9.1 45.72,12.7 48.26,15.24 IC1.1
N$18
  Top 0.305: JP9.2 48.26,12.06 50.8,14.61 50.8,15.88 50.16,16.51 IC1.2
N$19
  Top 0.305: JP9.3 50.8,13.34 51.44,13.97 51.44,16.51 50.16,17.78 IC1.3
N$20
  Top 0.305: JP9.4 52.07,10.79 52.07,17.14 50.16,19.05 IC1.4
N$21
  Top 0.305: JP9.5 52.7,12.7 52.7,17.78 50.16,20.32 IC1.5
N$22
  Top 0.305: JP9.6 53.34,14.61 53.34,18.41 50.16,21.59 IC1.6
N$23
  Top 0.305: JP9.7 53.98,15.88 53.98,19.05 50.16,22.86 IC1.7
N$24
  Top 0.305: JP9.8 54.61,17.78 54.61,19.68 50.16,24.13 IC1.8
N$25
  Top 0.305: JP15.10 11.43,45.09 34.92,45.09 36.2,46.35 36.2,53.34 37.47,54.61 46.35,54.61 48.26,56.52 48.26,61.59 46.99,62.87 IC3.16
N$26  (1 unrouted)
  Top 0.305: JP3.1 67.31,9.53 63.5,13.34 63.5,16.51
N$27
  Top 0.305: JP3.2 69.85,10.79 67.31,10.79 64.77,13.34 IC2.3
N$28
  Top 0.305: JP3.3 71.75,11.43 67.94,11.43 66.04,13.34 IC2.4
N$29
  Top 0.305: JP3.4 73.66,12.06 68.58,12.06 67.31,13.34 IC2.5
N$30
  Top 0.305: JP3.5 75.56,12.7 69.22,12.7 68.58,13.34 IC2.6
N$31
  Top 0.305: IC2.7 69.85,13.97 70.48,13.34 77.47,13.34 JP3.6
N$32
  Top 0.305: IC2.8 71.12,14.61 71.75,13.97 79.38,13.97 JP3.7
N$33
  Top 0.305: JP12.8 46.99,67.94 56.52,67.94 57.15,67.31 57.15,64.77 56.77,64.22 IC4.11
N$42
  Top 0.305: JP15.2 12.7,60.33 12.7,57.78 14.61,55.88 19.68,55.88 IC3.3
N$43
  Top 0.305: IC3.4 21.59,55.24 13.97,55.24 12.06,57.15 12.06,58.42 JP15.3
N$44
  Top 0.305: IC3.5 23.5,54.61 13.34,54.61 JP15.4
N$45
  Top 0.305: JP15.5 11.43,53.98 25.4,53.98 IC3.6 29.21,59.05 26.67,61.59 R12.1
N$46
  Top 0.305: JP15.6 26.04,53.34 29.21,56.52 30.48,56.52 IC3.7
N$47
  Top 0.305: JP15.7 10.79,49.53 10.79,48.26 12.06,46.99 33.02,46.99 34.29,48.26 34.29,55.24 35.56,56.52 40.64,56.52 IC3.11
N$48
  Top 0.305: JP15.8 11.43,46.35 33.66,46.35 34.92,47.62 34.92,54.61 36.2,55.88 42.55,55.88 IC3.12
N$49
  Top 0.305: JP15.9 34.29,45.72 35.56,46.99 35.56,53.98 36.83,55.24 44.45,55.24 IC3.13
N$50
  Top 0.305: IC3.28 JP18.1
N$51
  Top 0.305: JP18.2 IC3.27
N$52
  Top 0.305: JP18.3 IC3.26
N$53
  Top 0.305: JP18.4 IC3.25
N$54
  Top 0.305: JP18.5 IC3.24
N$55
  Top 0.305: JP18.6 IC3.23
N$56
  Top 0.305: JP18.7 IC3.22
N$57
  Top 0.305: JP18.8 IC3.21
N$58
  Top 0.305: IC3.18 JP18.9
N$59
  Top 0.305: JP18.10 IC3.17
N$61
  Top 0.305: IC4.7 62.87,62.27 64.14,63.5 64.14,68.58 JP12.1
N$62
  Top 0.305: JP12.2 59.05,69.85 59.05,62.87 58.42,62.27 IC4.14
N$63  (via drill 0.4)
  Top 0.305: IC4.8 v60.33,62.92
  Bottom 0.305: JP12.3 57.78,70.48 61.59,66.67 61.59,63.5 60.96,62.92 v60.33,62.92
N$64
  Top 0.305: JP12.4 55.88,69.22 57.78,69.22 58.42,68.58 58.42,63.5 57.78,62.92 IC4.13
N$65  (via drill 0.4)
  Top 0.305: IC4.9 62.87,63.58 63.5,64.14 63.5,64.77 62.87,65.41 v60.33,65.41
  Bottom 0.305: v60.33,65.41 57.78,65.41 52.7,70.48 JP12.5
N$66
  Top 0.305: JP12.6 51.44,68.58 57.15,68.58 57.78,67.94 57.78,64.14 57.15,63.58 IC4.12
N$67  (via drill 0.4)
  Top 0.305: IC4.10 v60.33,64.22
  Bottom 0.305: JP12.7 48.26,69.22 52.7,69.22 57.78,64.22 v60.33,64.22
N$71
  Top 0.305: LED1.C R13.2
S-32-BUS3
  Bottom 0.305: JP2.3 87.63,55.24 90.81,55.24 92.08,56.52 92.72,56.52 JP1.3
S-32-BUS4
  Bottom 0.305: JP2.4 90.8,56.51 92.08,57.78 94.61,57.78 JP1.4
S-32-BUS5
  Bottom 0.305: JP2.5 87.63,52.7 90.81,52.7 92.07,53.97 JP1.5
S-32-BUS6  (1 unrouted)
  Bottom 0.305: JP1.6 94.61,55.24 92.08,55.24 90.81,53.98 JP2.6
S-32-BUS7
  Bottom 0.305: JP2.7 87.63,50.16 90.81,50.16 92.07,51.43 JP1.7
S-32-BUS8
  Bottom 0.305: JP1.8 94.61,52.7 92.08,52.7 90.8,51.43 JP2.8
S-32-BUS9  (via drill 0.4)
  Top 0.305: SD.2 76.02,69.39 74.93,68.3 v74.93,57.15 R10.2
  Bottom 0.305: v74.93,57.15 74.93,48.9 75.56,48.26 85.72,48.26 JP2.9 | JP2.9 | JP2.9 87,48.9 88.27,47.62 90.81,47.62 92.07,48.89 JP1.9
S-32-BUS10
  Top 0.305: SD.7 80.42,70.08 77.47,66.67 77.47,52.07 | R8.2 77.47,52.07 | 77.47,52.07 77.47,48.58 78.42,47.62 86.99,47.62 88.27,48.9 88.27,48.89 JP2.10
  Bottom 0.305: JP1.10 94.61,50.16 92.08,50.16 90.8,48.89 JP2.10
S-32-BUS11  (via drill 0.4)  (1 unrouted)
  Top 0.305: SD.5 78.22,69.73 76.2,67.63 v76.2,54.61 R9.2 | JP2.11 85.72,46.99 77.47,46.99 76.2,48.26 v76.2,50.48
  Bottom 0.305: v76.2,54.61 v76.2,50.48 | JP2.11 87,46.35 88.27,45.09 90.81,45.09 92.07,46.35 JP1.11
S-32-BUS12  (via drill 0.4)
  Top 0.305: SD.1 74.92,69.86 73.66,68.58 v73.66,59.69 R11.2
  Bottom 0.305: v73.66,59.69 73.66,48.26 74.3,47.62 87,47.62 88.27,46.35 JP2.12 90.8,46.35 92.08,47.62 94.61,47.62 JP1.12
S-32-BUS13
  Bottom 0.305: JP2.13 87.63,42.55 90.81,42.55 92.07,43.81 JP1.13
S-32-BUS17
  Bottom 0.305: JP1.17 92.08,38.73 90.81,37.47 87.63,37.47 JP2.17
S-32-BUS18  (1 unrouted)
  Top 0.305: T3.2 R15.1 58.95,37.78 58.96,37.78 59.05,37.78 59.69,38.42 59.69,43.18
  Bottom 0.305: JP1.18 94.61,40.01 92.08,40.01 90.8,38.73 JP2.18 88.27,38.73 87,40.01 85.72,40.01 85.09,40.64 63.82,40.64 61.28,43.18 60.33,43.18
S-32-BUS19  (1 unrouted)
  Top 0.305: T4.2 R17.1 | R17.1 50.8,36.83 | 50.8,36.41 R17.1 | R17.1 50.8,38.1 52.07,39.37
  Bottom 0.305: JP1.19 92.07,36.19 90.81,34.92 87.62,34.92 JP2.19 85.09,34.92 67.63,34.92 63.18,39.37 52.7,39.37
S-32-BUS20
  Bottom 0.305: JP1.20 94.61,37.47 92.08,37.47 90.8,36.19 JP2.20
S-32-BUS21
  Bottom 0.305: JP2.21 87.62,32.38 90.81,32.38 92.07,33.65 JP1.21
S-32-BUS22
  Bottom 0.305: JP1.22 94.61,34.92 92.08,34.92 90.8,33.65 JP2.22
S-32-BUS23
  Bottom 0.305: JP2.23 87.62,29.84 90.81,29.84 92.07,31.11 JP1.23
S-32-BUS24
  Bottom 0.305: JP1.24 94.61,32.38 92.08,32.38 90.8,31.11 JP2.24
S-32-BUS25  (1 unrouted)
  Top 0.305: IC2.18 64.77,28.57 68.58,32.38 83.19,32.38 86.36,29.21 JP2.25
  Bottom 0.305: JP2.25 87.62,27.3 90.81,27.3 92.07,28.57 JP1.25
S-32-BUS26
  Top 0.305: IC2.17 66.04,28.57 69.22,31.75 82.55,31.75 85.09,29.21 85.09,27.94 85.72,27.3 87.64,27.3 JP2.26
  Bottom 0.305: JP1.26 94.61,29.84 92.08,29.84 90.8,28.57 JP2.26
S-32-BUS27
  Top 0.305: IC2.16 67.31,28.57 69.85,31.11 76.83,31.11 77.47,30.48 77.47,24.13 78.11,23.5 83.19,23.5 85.72,26.04 JP2.27
  Bottom 0.305: JP2.27 87.63,24.77 90.81,24.77 92.07,26.03 JP1.27
S-32-BUS28
  Top 0.305: IC2.15 68.58,28.57 70.48,30.48 76.2,30.48 76.83,29.84 76.83,23.5 77.47,22.86 83.82,22.86 85.72,24.77 87.64,24.77 JP2.28
  Bottom 0.305: JP1.28 94.61,27.3 92.08,27.3 90.8,26.03 JP2.28
S-32-BUS29
  Top 0.305: IC2.14 69.85,28.57 71.12,29.84 75.56,29.84 76.2,29.21 76.2,22.86 76.83,22.23 84.45,22.23 85.72,23.5 JP2.29
  Bottom 0.305: JP2.29 87.62,22.23 90.81,22.23 92.07,23.49 JP1.29
S-32-BUS30
  Top 0.305: IC2.13 71.12,28.57 71.75,29.21 74.93,29.21 75.56,28.57 75.56,22.23 76.2,21.59 85.09,21.59 85.72,22.23 87.64,22.23 JP2.30
  Bottom 0.305: JP1.30 94.61,24.77 92.08,24.77 90.8,23.49 JP2.30
S-32-BUS31
  Top 0.305: IC2.12 72.39,27.94 73.03,28.57 74.3,28.57 74.93,27.94 74.93,21.59 75.56,20.95 85.09,20.95 JP2.31
  Bottom 0.305: JP2.31 87.62,19.68 90.81,19.68 92.07,20.95 JP1.31
S-32-BUS32
  Top 0.305: IC2.11 73.66,20.95 74.93,19.68 87.64,19.68 JP2.32
  Bottom 0.305: JP1.32 94.61,22.23 92.08,22.23 90.8,20.95 JP2.32
SCL3  (via drill 0.4)
  Top 0.305: R2.1 72.56,38.42 v72.56,43.18 T1.2
  Bottom 0.305: JP1.14 94.61,45.09 92.08,45.09 90.8,43.81 JP2.14 88.27,43.81 87,45.09 73.66,45.09 72.56,43.98 v72.56,43.18
SCL5  (via drill 0.4)  (1 unrouted)
  Top 0.305: v72.39,49.53 73.66,49.53 76.2,46.99 76.2,46.35 | T1.3 76.2,46.35 | IC4.19 50.2,59.02 | 50.16,59.02 49.53,58.42 IC3.14 49.53,56.52 46.99,53.98 43.81,53.98 43.18,53.34 43.18,29.84 43.81,29.21 IC1.12 55.88,29.21 62.23,35.56 62.23,44.45 62.87,45.09 v63.5,45.09 | R1.1 76.2,46.35
  Bottom 0.305: I2C.4 67.31,76.2 68.58,74.93 68.58,50.8 69.85,49.53 v72.39,49.53 72.39,46.99 70.48,45.09 v63.5,45.09
SDA3  (via drill 0.4)
  Top 0.305: T2.2 66.04,42.7 v66.04,41.27 R4.1
  Bottom 0.305: JP2.15 | JP2.15 v66.04,41.27 | JP1.15 92.07,41.27 90.81,40.01 88.27,40.01 87,41.27 JP2.15
SDA5  (via drill 0.4)
  Top 0.305: T2.3 69.85,43.81 | 69.85,43.81 R3.1 | v69.85,46.35 69.85,43.81 | IC4.18 56.22,59.69 50.16,59.69 49.53,60.33 IC3.15 | v63.5,46.35 62.23,46.35 61.59,45.72 61.59,36.2 55.88,30.48 IC1.13 44.45,30.48 43.81,31.11 43.81,52.7 44.45,53.34 47.62,53.34 50.16,55.88 v50.8,55.88
  Bottom 0.305: I2C.1 66.67,46.35 | 66.67,46.35 v69.85,46.35 | v63.5,46.35 66.67,46.35 | v50.8,55.88 50.8,59.05 49.53,60.33 IC3.15
SERVO+5V
  Top 1.016: JP19.10 JP19.1 12.7,73.03 6.99,67.31 JP16.1 JP16.10 6.99,41.91 10.79,38.1 10.79,36.16 IC6.3 14.09,35.94 C6.+
  Bottom 1.016: JP19.10 JP19.9 JP19.8 JP19.7 JP19.6 JP19.5 JP19.4 JP19.3 JP19.2 JP19.1 | JP16.10 JP16.9 JP16.8 JP16.7 JP16.6 JP16.5 JP16.4 JP16.3 JP16.2 JP16.1
VCC  (1 unrouted)
  Top 0.406: 13.97,15.5 13.97,13.97 13.97,13.6
  Top 1.016: 19.05,19.05 19.05,29.72 17.39,31.38 IC6.1 11.29,31.11 | 13.97,15.5 17.53,15.5 19.05,17.02 19.05,19.05 | 13.97,15.5 13.97,10.13 POWER.1 | SRV1-PWR.1 30.48,17.78 29.21,19.05 19.05,19.05 | 13.97,15.5 IC8.1 | C8.1 14.35,13.6 13.97,13.97 | C5.1 10.79,28.57 10.79,31.11

### Text on the board
tValues: 20 | 11 | 8 | 1 | 1 | 1 | 2 | 1 | 2 | 10 | SRV-1 Expansion board MART 2012 | 31 | 32 | 31 | 32 | A0 | A7 | B0 | B7 | 0 | 7